# EAGLE design ContunityTestingRig (EAGLE 9.6.2)
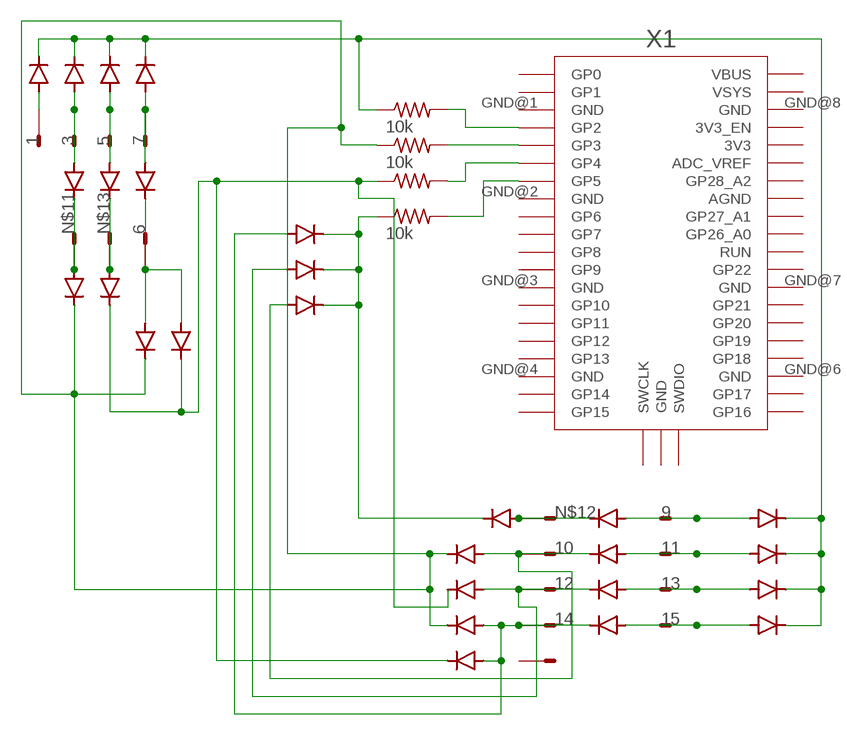
[diagram p0: schematic, sheet 1]

## Parts
D1  SCHOTTKY  DIODE_SCHOTTKY_CDBM1100-G  [MINI-SMA]
D2  SCHOTTKY  DIODE_SCHOTTKY_CDBM1100-G  [MINI-SMA]
D3  SCHOTTKY  DIODE_SCHOTTKY_CDBM1100-G  [MINI-SMA]
D4  SCHOTTKY  DIODE_SCHOTTKY_CDBM1100-G  [MINI-SMA]
D5  SCHOTTKY  DIODE_SCHOTTKY_CDBM1100-G  [MINI-SMA]
D6  SCHOTTKY  DIODE_SCHOTTKY_CDBM1100-G  [MINI-SMA]
D7  SCHOTTKY  DIODE_SCHOTTKY_CDBM1100-G  [MINI-SMA]
D8  SCHOTTKY  DIODE_SCHOTTKY_CDBM1100-G  [MINI-SMA]
D9  SCHOTTKY  DIODE_SCHOTTKY_CDBM1100-G  [MINI-SMA]
D10  SCHOTTKY  DIODE_SCHOTTKY_CDBM1100-G  [MINI-SMA]
D11  SCHOTTKY  DIODE_SCHOTTKY_CDBM1100-G  [MINI-SMA]
D12  SCHOTTKY  DIODE_SCHOTTKY_CDBM1100-G  [MINI-SMA]
D13  SCHOTTKY  DIODE_SCHOTTKY_CDBM1100-G  [MINI-SMA]
D14  SCHOTTKY  DIODE_SCHOTTKY_CDBM1100-G  [MINI-SMA]
D15  SCHOTTKY  DIODE_SCHOTTKY_CDBM1100-G  [MINI-SMA]
D16  SCHOTTKY  DIODE_SCHOTTKY_CDBM1100-G  [MINI-SMA]
D17  SCHOTTKY  DIODE_SCHOTTKY_CDBM1100-G  [MINI-SMA]
D18  SCHOTTKY  DIODE_SCHOTTKY_CDBM1100-G  [MINI-SMA]
D19  SCHOTTKY  DIODE_SCHOTTKY_CDBM1100-G  [MINI-SMA]
D20  SCHOTTKY  DIODE_SCHOTTKY_CDBM1100-G  [MINI-SMA]
D21  SCHOTTKY  DIODE_SCHOTTKY_CDBM1100-G  [MINI-SMA]
D22  SCHOTTKY  DIODE_SCHOTTKY_CDBM1100-G  [MINI-SMA]
D23  SCHOTTKY  DIODE_SCHOTTKY_CDBM1100-G  [MINI-SMA]
D24  SCHOTTKY  DIODE_SCHOTTKY_CDBM1100-G  [MINI-SMA]
D25  SCHOTTKY  DIODE_SCHOTTKY_CDBM1100-G  [MINI-SMA]
D26  SCHOTTKY  DIODE_SCHOTTKY_CDBM1100-G  [MINI-SMA]
D27  SCHOTTKY  DIODE_SCHOTTKY_CDBM1100-G  [MINI-SMA]
R1  10k  R1206FAB  [R1206FAB]
R2  10k  R1206FAB  [R1206FAB]
R3  10k  R1206FAB  [R1206FAB]
R4  10k  R1206FAB  [R1206FAB]
SV1  16E  [16P]
X1  RPI_PICO_IG-SMD  [RPI_PICO]

## Nets
1: D1.KATHODE D2.KATHODE D3.KATHODE D13.KATHODE D14.KATHODE D15.KATHODE D16.KATHODE D24.KATHODE R1.1
3: D1.ANODE D4.ANODE SV1.3
4: D7.KATHODE D17.KATHODE D18.KATHODE D25.KATHODE R2.1
5: D2.ANODE D5.ANODE SV1.5
6: D6.KATHODE D7.ANODE D8.ANODE SV1.6
7: D3.ANODE D6.ANODE SV1.7
8: D21.KATHODE D22.KATHODE D23.KATHODE D26.KATHODE R4.1
9: D9.ANODE D13.ANODE SV1.9
10: D10.KATHODE D17.ANODE D23.ANODE SV1.10
11: D10.ANODE D14.ANODE SV1.11
12: D11.KATHODE D19.ANODE D22.ANODE SV1.12
13: D11.ANODE D15.ANODE SV1.13
14: D12.KATHODE D18.ANODE D20.ANODE D21.ANODE SV1.14
15: D12.ANODE D16.ANODE SV1.15
N$1: R1.2 X1.GP2
N$2: R2.2 X1.GP3
N$3: R3.2 X1.GP4
N$4: R4.2 X1.GP5
N$6: D8.KATHODE D19.KATHODE D20.KATHODE D27.KATHODE R3.1
N$10: D24.ANODE SV1.1
N$11: D4.KATHODE D25.ANODE SV1.2
N$12: D9.KATHODE D26.ANODE SV1.8
N$13: D5.KATHODE D27.ANODE SV1.4
Unconnected: SV1.16 X1.3V3 X1.3V3_EN X1.ADC_VREF X1.AGND X1.GND@1(GND) X1.GND@2(GND) X1.GND@3(GND) X1.GND@4(GND) X1.GND@5(GND) X1.GND@6(GND) X1.GND@7(GND) X1.GND@8(GND) X1.GP0 X1.GP1 X1.GP6 X1.GP7 X1.GP8 X1.GP9 X1.GP10 X1.GP11 X1.GP12 X1.GP13 X1.GP14 X1.GP15 X1.GP16 X1.GP17 X1.GP18 X1.GP19 X1.GP20 X1.GP21 X1.GP22 X1.GP26_A0 X1.GP27_A1 X1.GP28_A2 X1.RUN X1.SWCLK X1.SWDIO X1.VBUS X1.VSYS

## Library data of the parts
D1-D27 = eagle_fab:DIODE_SCHOTTKY_CDBM1100-G: Diode schottky 100V 1A mini-SMA as found in the fablab inventory Reverse Voltage: 100 Volts Forward Current: 1.0 Amp Maximum forward voltage: 0.85 Volts Made by Zaerc.
R1-R4 = eagle_fab:R: Resistor (US Symbol) Variants with postfix FAB are widened to allow the routing of internal traces
SV1 = con-dil:16E: DIL CABLE CONNECTOR
X1 = RaspberryPi_Pico:RPI_PICO_IG

## Net classes
0 default: width 0.457 mm

## Board
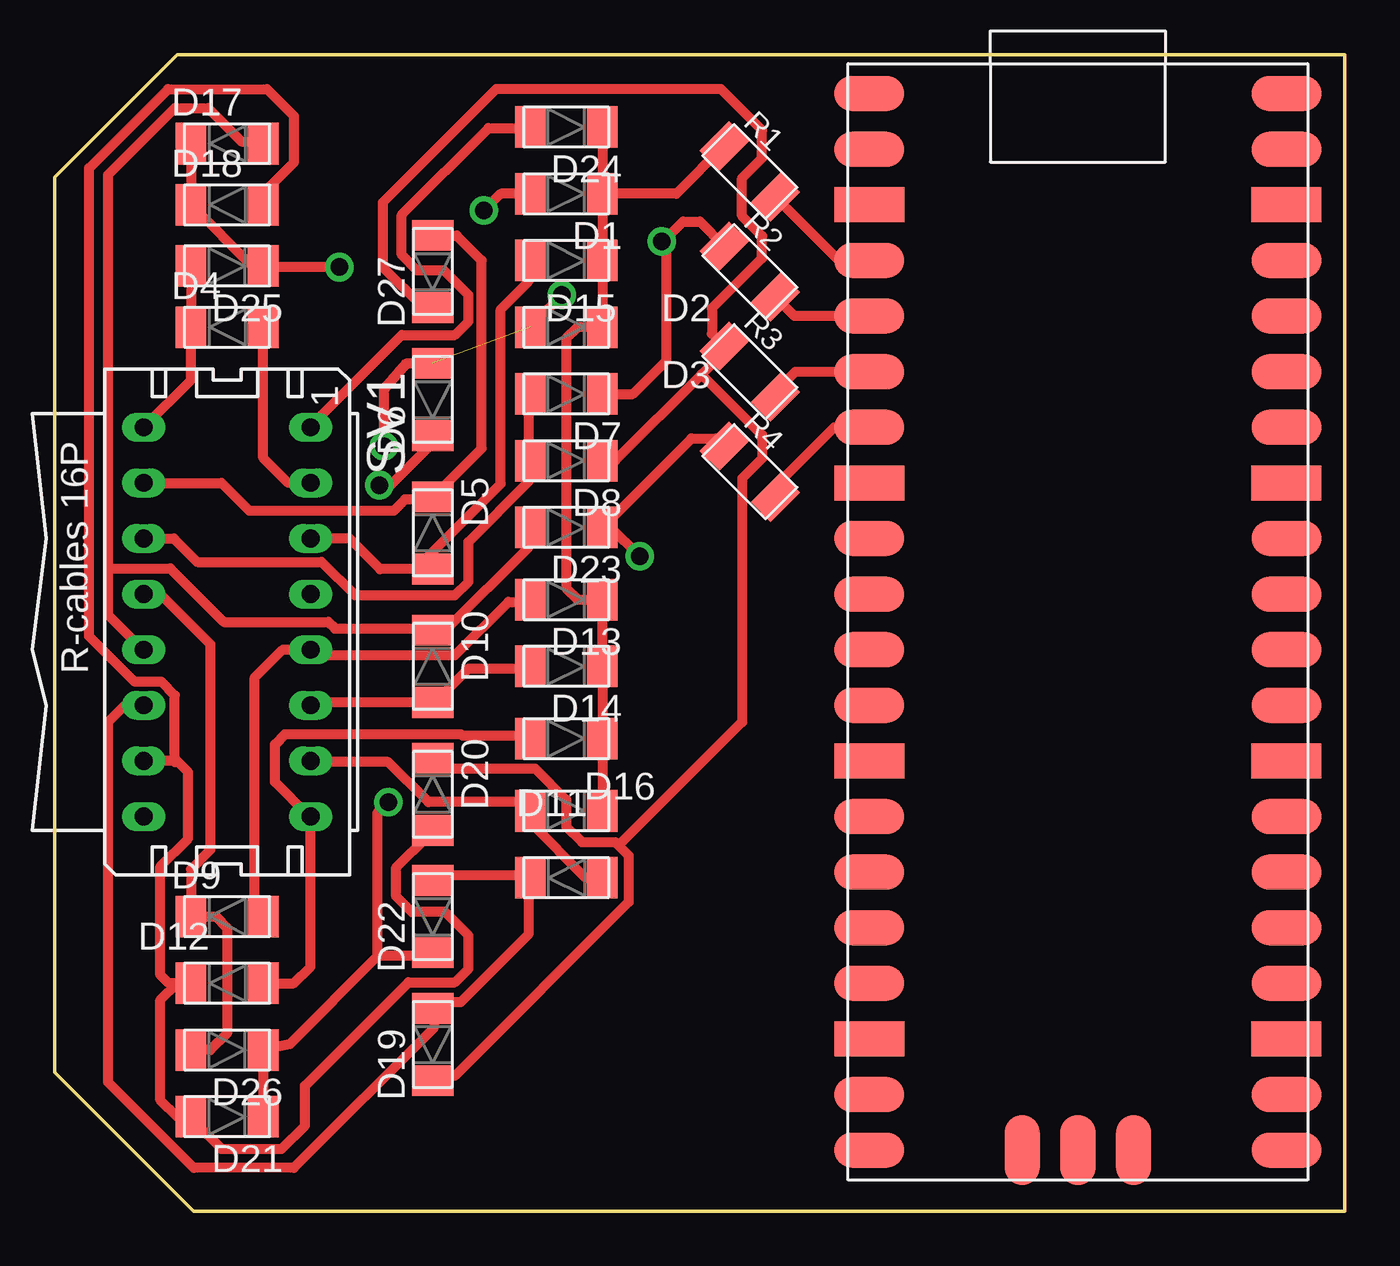
[diagram p1: board, top side]
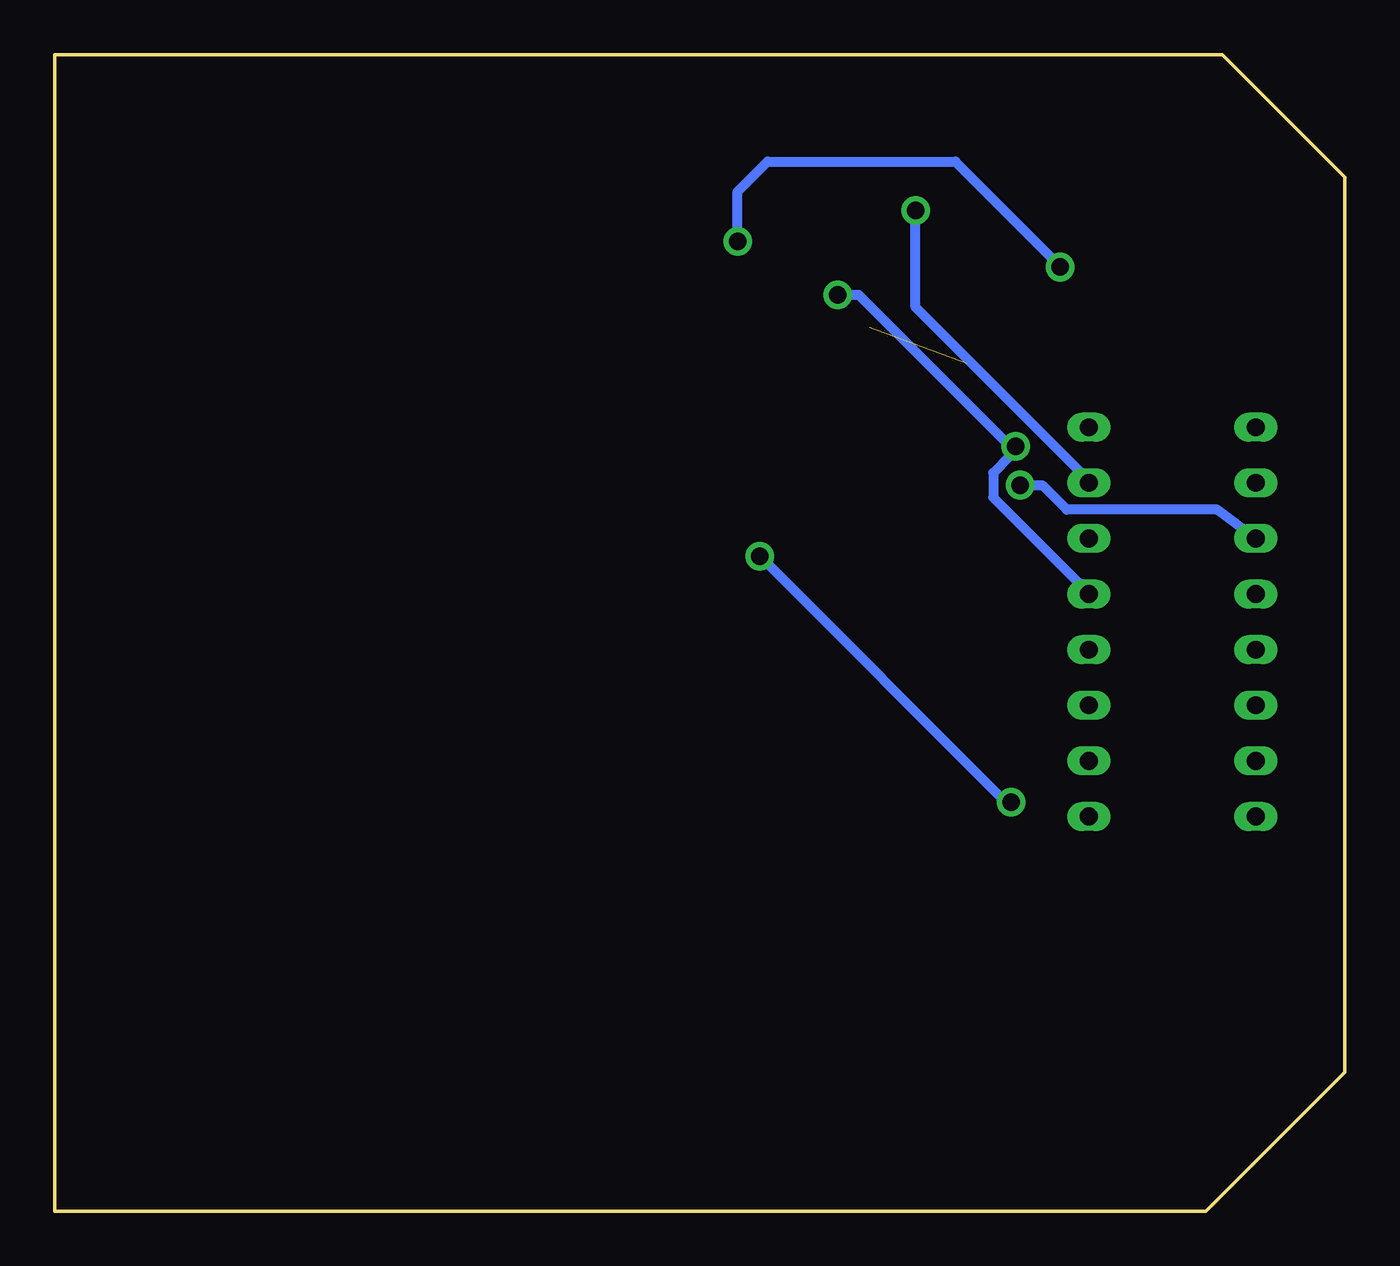
[diagram p2: board, bottom side, seen from below]

Size 58.93 x 52.83 mm. Coordinates in mm from the lower left corner, seen from the top.
Outline: 58.93,52.83 5.59,52.83 0,47.24 0,6.35 6.35,0 58.93,0 58.93,52.83
Copper layers (1*16): Top 0.035mm / dielectric 1.5mm / Bottom 0.035mm
Design rules "OthermillDRC_30_deg_v2": minimum track width 6mil, minimum drill 0.8mm, track to track 6mil, track to pad 6mil, pad to pad 6mil, via to via 6mil, smd to smd 0mil, copper to edge 0mil, drill to drill 6mil, minimum pad ring 10mil, minimum via ring 10mil, stop-mask expansion 1mil, vias tented up to drill 30mil, thermal gap 6mil

### Footprints (pad centres in the part's own frame; a part is rotated, then mirrored left to right if it is on the bottom)
MINI-SMA = smd 1.4 x 1.9: ANODE 1.65,0; KATHODE -1.65,0
R1206FAB = smd 1.27 x 1.905: 1 -1.651,0; 2 1.651,0
16P = drill 0.813 long: 1 -8.89,3.81; 2 -8.89,-3.81; 3 -6.35,3.81; 4 -6.35,-3.81; 5 -3.81,3.81; 6 -3.81,-3.81; 7 -1.27,3.81; 8 -1.27,-3.81; 9 1.27,3.81; 10 1.27,-3.81; 11 3.81,3.81; 12 3.81,-3.81; 13 6.35,3.81; 14 6.35,-3.81; 15 8.89,3.81; 16 8.89,-3.81
RPI_PICO = smd 3.2 x 1.6: 3V3 9.525,13.97; 3V3_EN 9.525,16.51; ADC_VREF 9.525,11.43; AGND 9.525,6.35; GND@1 -9.525,19.05; GND@2 -9.525,6.35; GND@3 -9.525,-6.35; GND@4 -9.525,-19.05; GND@6 9.525,-19.05; GND@7 9.525,-6.35; GND@8 9.525,19.05; GP0 -9.525,24.13; GP1 -9.525,21.59; GP2 -9.525,16.51; GP3 -9.525,13.97; GP4 -9.525,11.43; GP5 -9.525,8.89; GP6 -9.525,3.81; GP7 -9.525,1.27; GP8 -9.525,-1.27; GP9 -9.525,-3.81; GP10 -9.525,-8.89; GP11 -9.525,-11.43; GP12 -9.525,-13.97; GP13 -9.525,-16.51; GP14 -9.525,-21.59; GP15 -9.525,-24.13; GP16 9.525,-24.13; GP17 9.525,-21.59; GP18 9.525,-16.51; GP19 9.525,-13.97; GP20 9.525,-11.43; GP21 9.525,-8.89; GP22 9.525,-3.81; GP26_A0 9.525,1.27; GP27_A1 9.525,3.81; GP28_A2 9.525,8.89; RUN 9.525,-1.27; VBUS 9.525,24.13; VSYS 9.525,21.59 | smd 1.6 x 3.2: GND@5 0,-24.13; SWCLK -2.54,-24.13; SWDIO 2.54,-24.13

### Placement (x,y rotation side)
D1  23.37,46.48 180 top
D2  23.37,43.43 180 top
D3  23.37,40.39 180 top
D4  7.87,40.39 0 top
D5  17.27,30.99 270 top
D6  17.27,37.08 90 top
D7  23.37,37.34 180 top
D8  23.37,34.29 180 top
D9  7.87,13.46 0 top
D10  17.27,24.89 270 top
D11  23.37,15.24 0 top
D12  7.87,10.41 0 top
D13  23.37,27.94 180 top
D14  23.37,24.89 180 top
D15  23.37,18.29 180 top
D16  23.37,21.59 180 top
D17  7.87,48.77 0 top
D18  7.87,45.97 0 top
D19  17.27,7.62 90 top
D20  17.27,19.05 270 top
D21  7.87,4.32 180 top
D22  17.27,13.46 90 top
D23  23.37,31.24 180 top
D24  23.37,49.53 180 top
D25  7.87,43.18 180 top
D26  7.87,7.37 180 top
D27  17.27,42.93 90 top
R1  31.75,47.5 315 top
R2  31.75,42.93 315 top
R3  31.75,38.35 315 top
R4  31.75,33.78 315 top
SV1  7.87,26.92 270 top
X1  46.74,26.92 0 top

### Tracks (layer width: path | path; a pad name or v marks a point on that pad's centre or on a via)
1
  Top 0.457: D1.KATHODE D2.KATHODE D3.KATHODE 23.88,40.39 23.37,39.88 23.37,28.45 23.88,27.94 D13.KATHODE D14.KATHODE D16.KATHODE D15.KATHODE | R1.1 28.4,46.48 D1.KATHODE | D24.KATHODE D1.KATHODE
3  (via drill 0.8)
  Top 0.457: SV1.3 10.67,33.27 9.52,34.42 D4.ANODE | D1.ANODE 20.37,46.48 v19.61,45.72
  Bottom 0.457: v19.61,45.72 19.61,41.3 11.68,33.38 SV1.3
4  (via drill 0.8)
  Top 0.457: D17.KATHODE D18.KATHODE 9.02,43.18 D25.KATHODE 9.58,43.13 v13.01,43.13 | D7.KATHODE 26.42,37.34 27.94,38.86 27.94,44.3 | 27.94,44.3 27.94,44.45 28.7,45.21 29.46,45.21 R2.1 | R2.1 | v27.74,44.3 27.94,44.3
  Bottom 0.457: v13.01,43.13 13.01,43.18 17.78,47.95 26.37,47.95 27.74,46.58 v27.74,44.3
5
  Top 0.457: SV1.5 13.46,30.73 14.86,29.34 D5.ANODE 16.52,29.37 20.37,33.22 20.37,41.2 21.64,42.47 21.64,43.38 D2.ANODE
6  (via drill 0.8)
  Top 0.457: D7.ANODE 21.64,37.29 21.64,34.54 D8.ANODE 21.64,34.24 21.64,33.32 18.9,30.58 18.9,28.75 18.29,28.14 13.72,28.14 12.19,29.67 6.5,29.67 5.44,30.73 SV1.6 | D6.KATHODE 17.27,35.1 15.34,33.17 v14.83,33.17
  Bottom 0.457: v14.83,33.17 13.82,33.17 12.7,32.05 5.83,32.05 | 5.83,32.05 | 5.83,32.05 SV1.6
7  (via drill 0.8)  (1 unrouted)
  Top 0.457: D6.ANODE 16.08,38.73 15.04,37.56 v15.04,34.95 | v23.17,41.86 21.95,40.64 D3.ANODE
  Bottom 0.457: SV1.7 11.89,28.45 16.05,32.61 16.05,33.73 15.29,34.49 15.29,34.95 22.2,41.86 v23.17,41.86
8  (via drill 0.8)
  Top 0.457: D21.KATHODE D26.KATHODE 10.73,7.63 14.78,11.68 | R4.1 30.23,35.31 29.08,35.31 D23.KATHODE 25.4,31.24 v26.72,29.92 | 14.78,11.68 14.73,11.68 14.73,18.19 v15.24,18.69 | 14.78,11.68 17.07,11.68 D22.KATHODE
  Bottom 0.457: v26.72,29.92 15.49,18.69 v15.24,18.69
9
  Top 0.457: D9.ANODE 9.14,13.84 9.14,24.38 10.41,25.65 SV1.9 11.89,25.4 18.29,25.4 20.73,27.84 21.64,27.84 D13.ANODE
10
  Top 0.457: D23.ANODE 21.64,31.19 21.64,30.33 17.86,26.54 D10.KATHODE 17.07,26.62 12.8,26.62 12.5,26.92 7.72,26.92 5.28,29.36 2.44,29.36 | 2.44,29.36 2.44,27.23 3.96,25.7 SV1.10 | 2.44,29.36 2.44,47.35 5.49,50.39 7.01,50.39 8.53,48.87 9.45,48.87 D17.ANODE
11
  Top 0.457: SV1.11 11.89,23.27 17.07,23.27 D10.ANODE 17.37,23.27 18.9,24.79 21.64,24.79 D14.ANODE
12
  Top 0.457: D22.ANODE 17.37,15.34 21.64,15.34 D11.KATHODE 21.64,15.04 21.64,12.65 18.54,9.55 17.37,9.55 D19.ANODE 17.32,9.22 17.32,8.38 10.92,1.98 6.35,1.98 2.44,5.89 2.44,22.35 3.2,23.11 SV1.12
13
  Top 0.457: D11.ANODE 24.26,15.24 21.72,17.78 D15.ANODE 21.64,18.39 21.34,18.69 17.07,18.69 15.24,20.52 11.89,20.52 SV1.13
14
  Top 0.457: D12.KATHODE 5.59,10.41 | 5.59,10.41 5.21,10.41 4.83,10.8 4.83,15.75 6.1,17.02 6.1,20.07 5.59,20.57 | 5.59,20.57 SV1.14 | 5.59,10.41 4.83,9.65 4.83,5.08 5.59,4.32 D21.ANODE 6.4,4.06 7.62,2.85 10.36,2.85 11.43,3.91 11.43,5.74 16.15,10.47 18.29,10.47 18.9,11.07 18.9,12.6 17.83,13.67 16.31,13.67 15.6,14.38 15.6,15.7 17.07,17.17 D20.ANODE | D18.ANODE 9.75,46.13 9.75,46.74 10.92,47.9 10.92,50.04 9.7,51.26 5.18,51.26 1.58,47.65 1.58,26.26 3.66,24.18 4.88,24.18 5.49,23.57 5.49,20.52 5.59,20.57
15
  Top 0.457: D12.ANODE 10.92,10.41 11.68,11.18 SV1.15 11.58,18.09 10.06,19.61 10.06,21.34 10.52,21.79 18.54,21.79 18.59,21.74 21.64,21.74 D16.ANODE
N$1
  Top 0.457: R1.2 35.81,43.43 X1.GP2 | R1.2
N$2
  Top 0.457: X1.GP3 33.78,40.89 R2.2
N$3
  Top 0.457: R3.2 32.92,37.44 33.83,38.35 X1.GP4
N$4
  Top 0.457: R4.2 32.92,33.12 35.61,35.81 X1.GP5
N$6
  Top 0.457: D8.KATHODE 25.61,34.29 29.54,38.23 | 29.54,38.23 30.58,39.27 R3.1 30.02,40.08 30.02,41.25 32.31,43.54 32.31,44.55 31.39,45.47 31.39,47.19 32.31,48.11 32.31,49.38 30.43,51.26 20.17,51.26 14.99,46.08 14.99,43.13 16.84,41.28 D27.KATHODE | 25.76,16.71 25.6,16.87 24.08,16.87 23.37,17.58 23.37,18.8 21.95,20.22 17.68,20.22 17.37,20.52 D20.KATHODE | 25.76,16.71 26.21,16.26 26.21,14.12 18.29,6.2 17.37,6.2 D19.KATHODE | 25.76,16.71 31.39,22.35 31.39,33.48 32.31,34.39 32.31,35.46 29.57,38.2 29.54,38.23
N$10
  Top 0.457: D24.ANODE 21.64,49.48 19.81,49.48 15.85,45.52 15.85,43.69 16.56,42.98 17.78,42.98 18.9,41.86 18.9,40.64 18.29,40.03 15.85,40.03 11.89,36.07 SV1.1
N$11
  Top 0.457: SV1.2 6.22,37.97 D4.KATHODE D25.ANODE
N$12
  Top 0.457: SV1.8 4.83,28.19 7.11,25.91 7.11,16.51 6.22,15.62 D9.KATHODE 7.37,13.46 7.87,12.95 7.87,8.13 7.11,7.37 D26.ANODE
N$13
  Top 0.457: SV1.4 7.62,33.27 8.89,32 15.49,32 16,32.51 17.15,32.51 D5.KATHODE 17.37,32.71 19.51,34.85 19.51,43.43 18.37,44.58 D27.ANODE